# Altium schematic sheet 5 - PWM Steering.SchDoc
size Tabloid
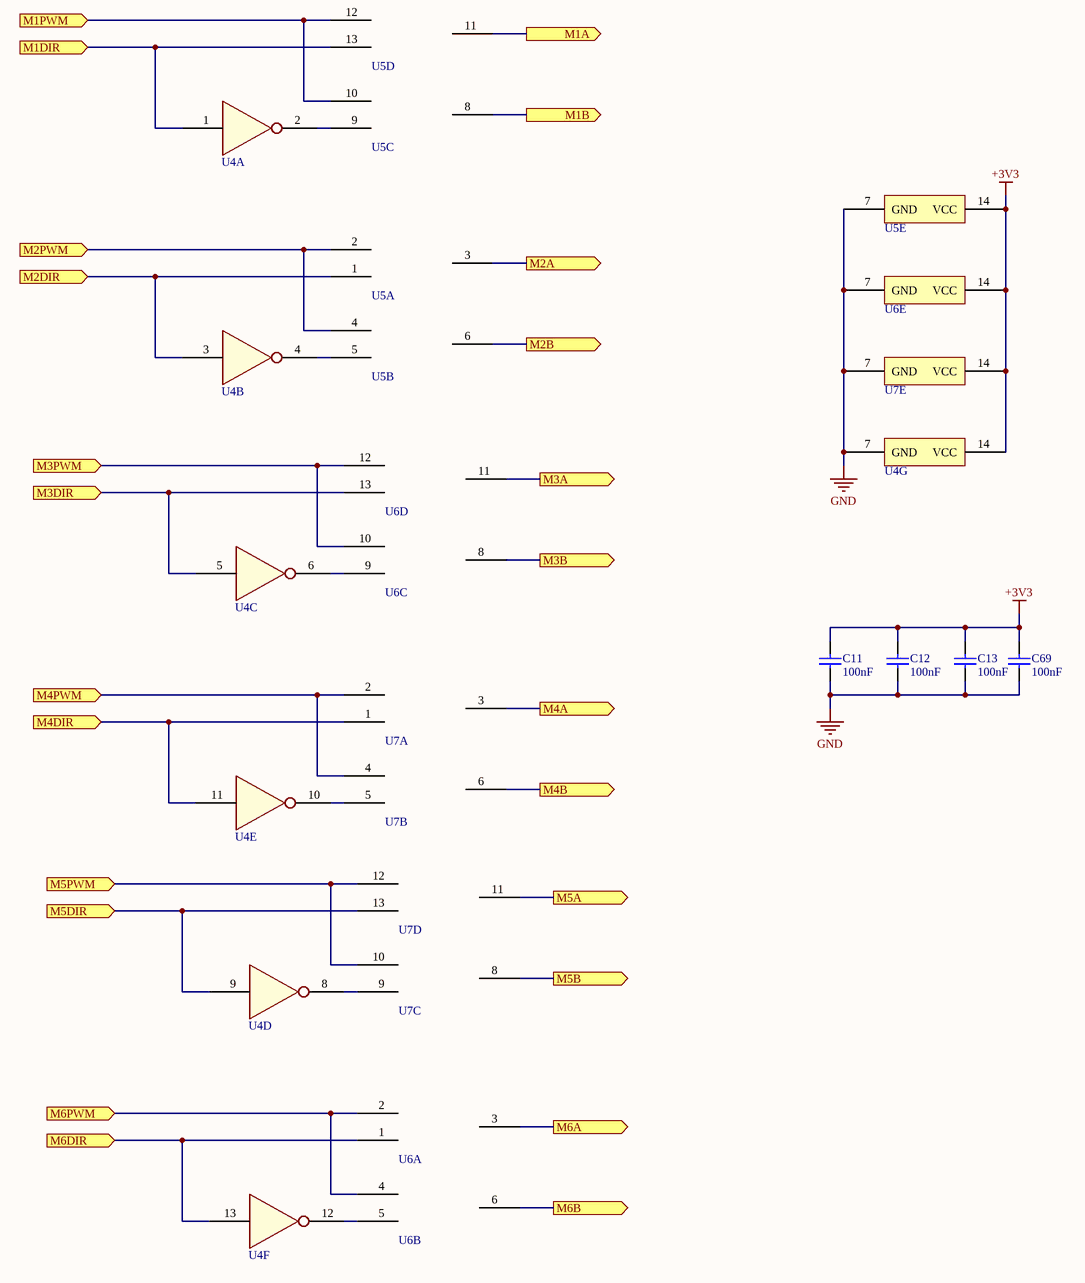
[diagram p0: 5 - PWM Steering.SchDoc]

## Parts
C11  value 100nF  [CAPC0805(2012)100_L]  (hidden comment: CAP 100nF 6.3V 0805(2012))
C12  value 100nF  [CAPC0805(2012)100_L]  (hidden comment: CAP 100nF 6.3V 0805(2012))
C13  value 100nF  [CAPC0805(2012)100_L]  (hidden comment: CAP 100nF 6.3V 0805(2012))
C69  value 100nF  [CAPC0805(2012)100_L]  (hidden comment: CAP 100nF 6.3V 0805(2012))
U4  Hex Inverter  [QFN50P300X250X100-15T110X160N]  (value not drawn)  (parts A,B,C,D,E,F,G of 7)
U5  Quad 2-Input AND Gate  [QFN50P300X250X100-15T110X160N]  (value not drawn)  (parts A,B,C,D,E of 5)
U6  Quad 2-Input AND Gate  [QFN50P300X250X100-15T110X160N]  (value not drawn)  (parts A,B,C,D,E of 5)
U7  Quad 2-Input AND Gate  [QFN50P300X250X100-15T110X160N]  (value not drawn)  (parts A,B,C,D,E of 5)

## Ports
M1A (out), M1B (out), M1DIR (in), M1PWM (in), M2A (out), M2B (out), M2DIR (in), M2PWM (in), M3A (out), M3B (out), M3DIR (in), M3PWM (in), M4A (out), M4B (out), M4DIR (in), M4PWM (in), M5A (out), M5B (out), M5DIR (in), M5PWM (in), M6A (out), M6B (out), M6DIR (in), M6PWM (in)

## Nets
+3V3: C11.2 C12.2 C13.2 C69.2 U4.14(VCC) U5.14(VCC) U6.14(VCC) U7.14(VCC)
GND: C11.1 C12.1 C13.1 C69.1 U4.7(GND) U5.7(GND) U6.7(GND) U7.7(GND)
M1A: U5.11(4Y) ; port M1A
M1B: U5.8(3Y) ; port M1B
M1DIR: U4.1(1A) U5.13(4B) ; port M1DIR
M1PWM: U5.10(3B) U5.12(4A) ; port M1PWM
M2A: U5.3(1Y) ; port M2A
M2B: U5.6(2Y) ; port M2B
M2DIR: U4.3(2A) U5.1(1A) ; port M2DIR
M2PWM: U5.2(1B) U5.4(2A) ; port M2PWM
M3A: U6.11(4Y) ; port M3A
M3B: U6.8(3Y) ; port M3B
M3DIR: U4.5(3A) U6.13(4B) ; port M3DIR
M3PWM: U6.10(3B) U6.12(4A) ; port M3PWM
M4A: U7.3(1Y) ; port M4A
M4B: U7.6(2Y) ; port M4B
M4DIR: U4.11(5A) U7.1(1A) ; port M4DIR
M4PWM: U7.2(1B) U7.4(2A) ; port M4PWM
M5A: U7.11(4Y) ; port M5A
M5B: U7.8(3Y) ; port M5B
M5DIR: U4.9(4A) U7.13(4B) ; port M5DIR
M5PWM: U7.10(3B) U7.12(4A) ; port M5PWM
M6A: U6.3(1Y) ; port M6A
M6B: U6.6(2Y) ; port M6B
M6DIR: U4.13(6A) U6.1(1A) ; port M6DIR
M6PWM: U6.2(1B) U6.4(2A) ; port M6PWM
NetU4_2: U4.2(1Y) U5.9(3A)
NetU4_4: U4.4(2Y) U5.5(2B)
NetU4_6: U4.6(3Y) U6.9(3A)
NetU4_8: U4.8(4Y) U7.9(3A)
NetU4_10: U4.10(5Y) U7.5(2B)
NetU4_12: U4.12(6Y) U6.5(2B)

## Library data of the parts
C11-C13 C69 = CMP-1036-04391-1: CAP 100nF 6.3V Â±10% 0805 (2012 Metric) Thickness 1mm SMD; Case-EIA: 0805; Case-Metric: 2012; Rated Voltage: 6.3 V; Technology: SMT; Tolerance: Â±10%; Max Thickness: 1 mm
U4 = 74LVC04A
U5-U7 = 74LVC08A